# EAGLE design Sensor Acquisition Board Rev3 (EAGLE 9.6.2)
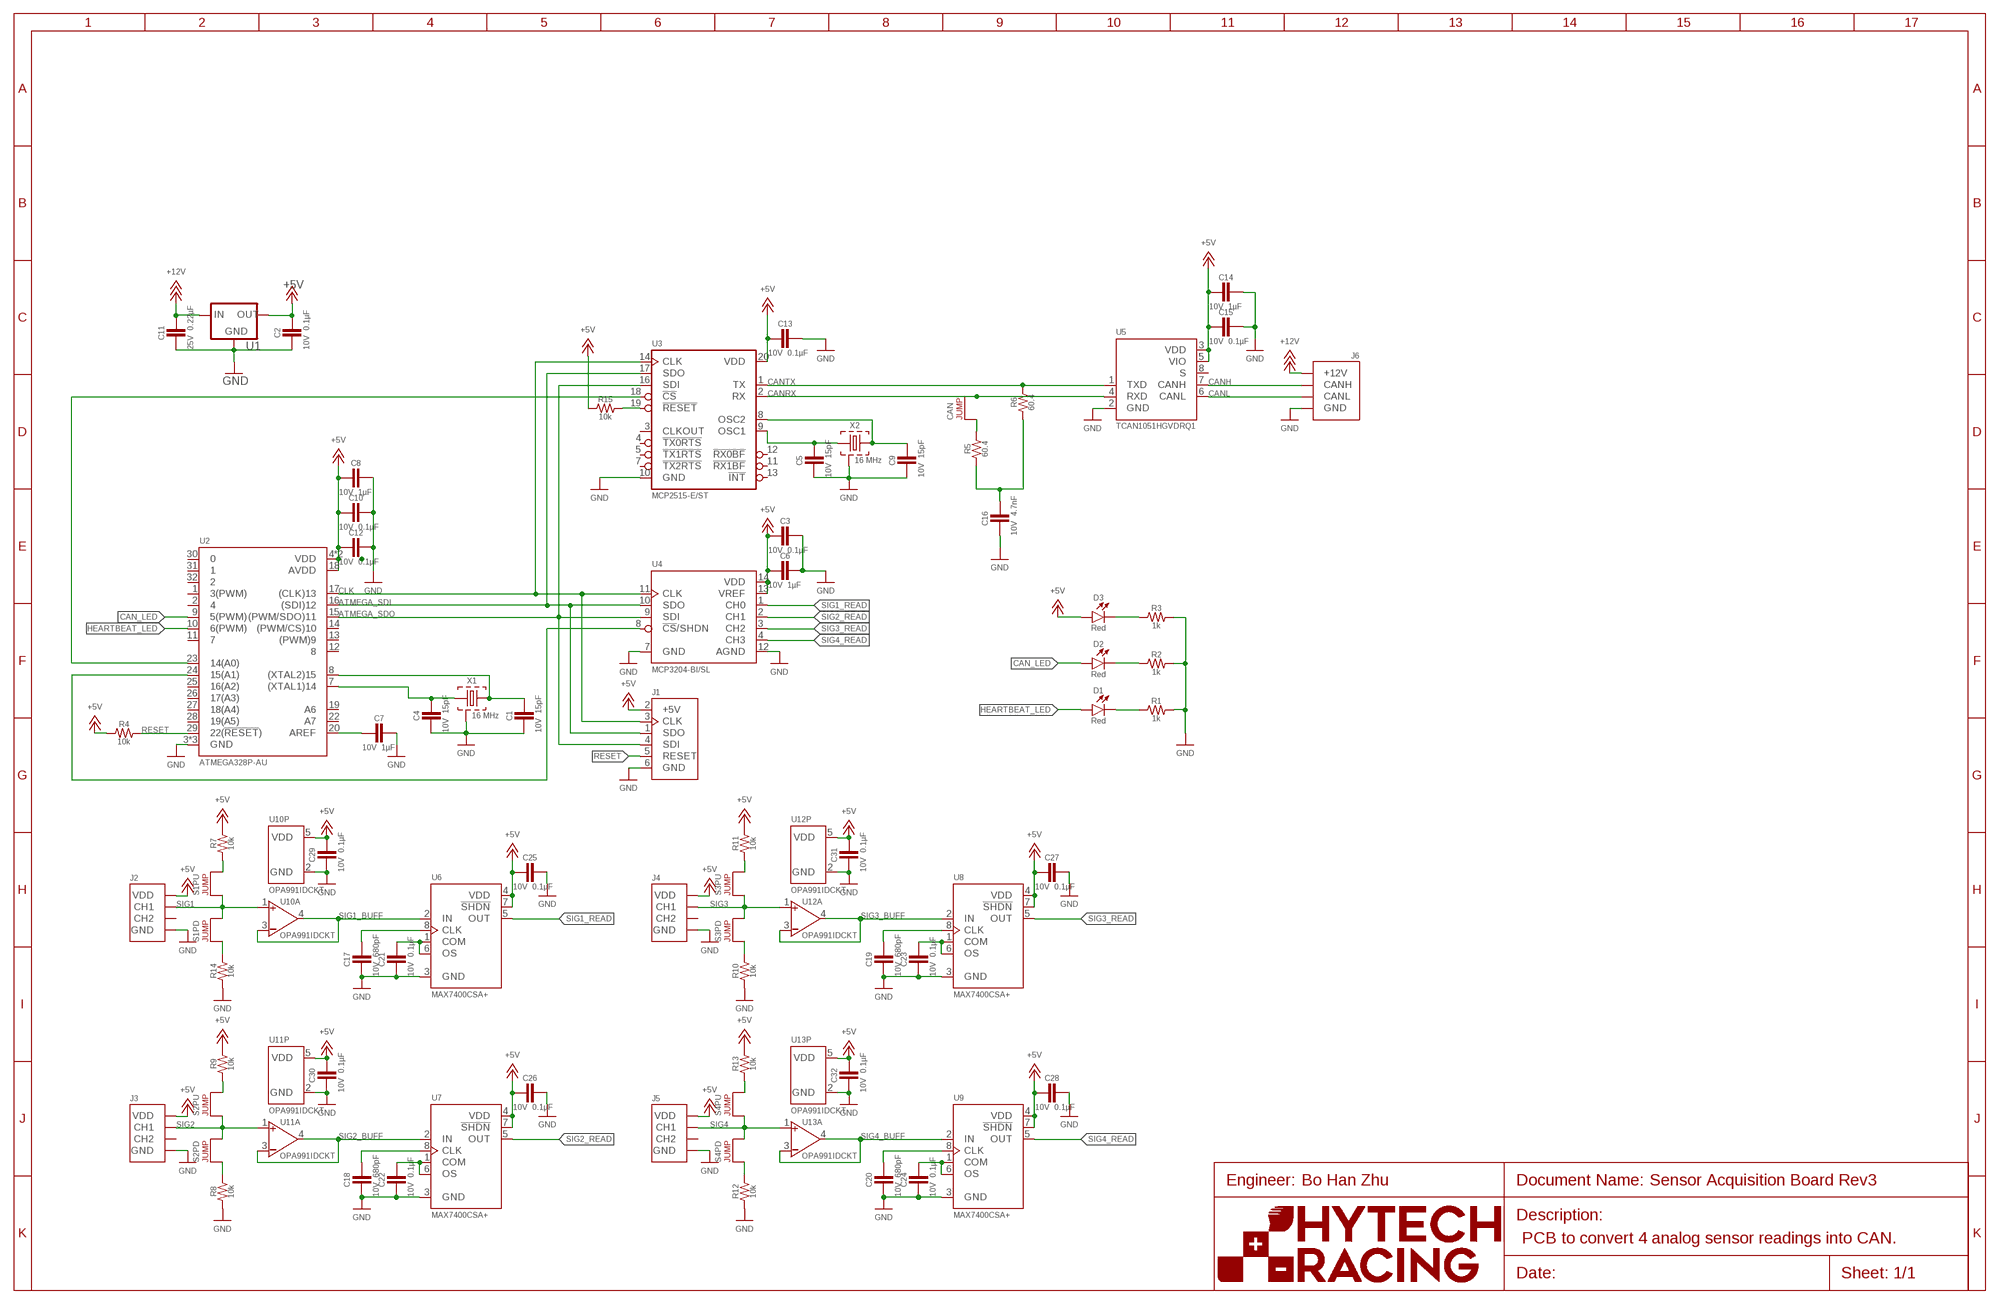
[diagram p0: schematic, sheet 1]
U$7 (FRAME_B): FRAME_DESCRIPTION: Default; ORIENTATION: LANDSCAPE; SIZE: B

## Parts
C1  CAPACITOR_0603_10V_15PF  [0603-CAP]
C2  CAPACITOR_0603_10V_0.1UF  [0603-CAP]
C3  CAPACITOR_0603_10V_0.1UF  [0603-CAP]
C4  CAPACITOR_0603_10V_15PF  [0603-CAP]
C5  CAPACITOR_0603_10V_15PF  [0603-CAP]
C6  CAPACITOR_0603_10V_1UF  [0603-CAP]
C7  CAPACITOR_0603_10V_1UF  [0603-CAP]
C8  CAPACITOR_0603_10V_1UF  [0603-CAP]
C9  CAPACITOR_0603_10V_15PF  [0603-CAP]
C10  CAPACITOR_0603_10V_0.1UF  [0603-CAP]
C11  CAPACITOR_0603_25V_0.22UF  [0603-CAP]
C12  CAPACITOR_0603_10V_0.1UF  [0603-CAP]
C13  CAPACITOR_0603_10V_0.1UF  [0603-CAP]
C14  CAPACITOR_0603_10V_1UF  [0603-CAP]
C15  CAPACITOR_0603_10V_0.1UF  [0603-CAP]
C16  CAPACITOR_0603_10V_4.7NF  [0603-CAP]
C17  CAPACITOR_0603_10V_680PF  [0603-CAP]
C18  CAPACITOR_0603_10V_680PF  [0603-CAP]
C19  CAPACITOR_0603_10V_680PF  [0603-CAP]
C20  CAPACITOR_0603_10V_680PF  [0603-CAP]
C21  CAPACITOR_0603_10V_0.1UF  [0603-CAP]
C22  CAPACITOR_0603_10V_0.1UF  [0603-CAP]
C23  CAPACITOR_0603_10V_0.1UF  [0603-CAP]
C24  CAPACITOR_0603_10V_0.1UF  [0603-CAP]
C25  CAPACITOR_0603_10V_0.1UF  [0603-CAP]
C26  CAPACITOR_0603_10V_0.1UF  [0603-CAP]
C27  CAPACITOR_0603_10V_0.1UF  [0603-CAP]
C28  CAPACITOR_0603_10V_0.1UF  [0603-CAP]
C29  CAPACITOR_0603_10V_0.1UF  [0603-CAP]
C30  CAPACITOR_0603_10V_0.1UF  [0603-CAP]
C31  CAPACITOR_0603_10V_0.1UF  [0603-CAP]
C32  CAPACITOR_0603_10V_0.1UF  [0603-CAP]
CAN  JUMPER_1X02_  [1X02]
D1  LED_0603_RED  [0603-LED]
D2  LED_0603_RED  [0603-LED]
D3  LED_0603_RED  [0603-LED]
J1  CONNECTOR-AVR-ISP__  [2X03]
J2  CONNECTOR-SENSOR_NF_S_RA_BLACK  [MOLEX_NANOFIT_SMD_RIGHTANGLE_04]
J3  CONNECTOR-SENSOR_NF_S_RA_BLACK  [MOLEX_NANOFIT_SMD_RIGHTANGLE_04]
J4  CONNECTOR-SENSOR_NF_S_RA_BLACK  [MOLEX_NANOFIT_SMD_RIGHTANGLE_04]
J5  CONNECTOR-SENSOR_NF_S_RA_BLACK  [MOLEX_NANOFIT_SMD_RIGHTANGLE_04]
J6  CONNECTOR-CAN_NF_S_RA_BLACK  [MOLEX_NANOFIT_SMD_RIGHTANGLE_04]
R1  RESISTOR_0603_1K  [0603-RES]
R2  RESISTOR_0603_1K  [0603-RES]
R3  RESISTOR_0603_1K  [0603-RES]
R4  RESISTOR_0603_10K  [0603-RES]
R5  RESISTOR_0603_60.4  [0603-RES]
R6  RESISTOR_0603_60.4  [0603-RES]
R7  RESISTOR_0603_10K  [0603-RES]
R8  RESISTOR_0603_10K  [0603-RES]
R9  RESISTOR_0603_10K  [0603-RES]
R10  RESISTOR_0603_10K  [0603-RES]
R11  RESISTOR_0603_10K  [0603-RES]
R12  RESISTOR_0603_10K  [0603-RES]
R13  RESISTOR_0603_10K  [0603-RES]
R14  RESISTOR_0603_10K  [0603-RES]
R15  RESISTOR_0603_10K  [0603-RES]
S1PD  JUMPER_1X02_  [1X02]
S1PU  JUMPER_1X02_  [1X02]
S2PD  JUMPER_1X02_  [1X02]
S2PU  JUMPER_1X02_  [1X02]
S3PD  JUMPER_1X02_  [1X02]
S3PU  JUMPER_1X02_  [1X02]
S4PD  JUMPER_1X02_  [1X02]
S4PU  JUMPER_1X02_  [1X02]
U1  LM340  [SOT223]
U2  ATMEGA328P-AU  [TQFP-32]
U3  MCP2515  [TSSOP-20]
U4  MCP3204  [SOIC-14]
U5  CAN_TRANSCIEVER_TCAN1051HQV-Q1  [SOIC-08]
U6  MAX7400  [SOIC-08(NARROW,0.15")]
U7  MAX7400  [SOIC-08(NARROW,0.15")]
U8  MAX7400  [SOIC-08(NARROW,0.15")]
U9  MAX7400  [SOIC-08(NARROW,0.15")]
U10  OPAMP_1_CHANNEL_OPA991  [SC-70-5]
U11  OPAMP_1_CHANNEL_OPA991  [SC-70-5]
U12  OPAMP_1_CHANNEL_OPA991  [SC-70-5]
U13  OPAMP_1_CHANNEL_OPA991  [SC-70-5]
X1  CRYSTAL16MHZ  [ABM3B]
X2  CRYSTAL16MHZ  [ABM3B]

## Nets
+5V: C2.1 C3.2 C6.2 C8.2 C10.2 C12.2 C13.2 C14.2 C15.2 C25.2 C26.2 C27.2 C28.2 C29.1 C30.1 C31.1 C32.1 D3.2(A) J1.2(+5V) J2.1(VDD) J3.1(VDD) J4.1(VDD) J5.1(VDD) R4.1 R7.2 R9.2 R11.2 R13.2 R15.1 U1.3(OUT) U2.4(VDD) U2.6(VDD) U2.18(AVDD) U3.20(VDD) U4.13(VREF) U4.14(VDD) U5.3(VDD) U5.5(VIO) U6.4(VDD) U6.7(!SHDN) U7.4(VDD) U7.7(!SHDN) U8.4(VDD) U8.7(!SHDN) U9.4(VDD) U9.7(!SHDN) U10.5(P:VDD) U11.5(P:VDD) U12.5(P:VDD) U13.5(P:VDD)
+12V: C11.1 J6.1(+12V) U1.1(IN)
ATMEGA_CS: U2.24(15(A1)) U4.8(!CS!/SHDN)
ATMEGA_SDI: J1.1(SDO) U2.16((SDI)12) U3.17(SDO) U4.10(SDO)
ATMEGA_SDO: J1.4(SDI) U2.15((PWM/SDO)11) U3.16(SDI) U4.9(SDI)
CAN_LED: D2.2(A) U2.9(5(PWM))
CANH: J6.4(CANH) U5.7(CANH)
CANL: J6.3(CANL) U5.6(CANL)
CANRX: CAN.2 U3.2(RX) U5.4(RXD)
CANTX: R6.2 U3.1(TX) U5.1(TXD)
CLK: J1.3(CLK) U2.17((CLK)13) U3.14(CLK) U4.11(CLK)
GND: C1.2 C2.2 C3.1 C4.2 C5.2 C6.1 C7.1 C8.1 C9.2 C10.1 C11.2 C12.1 C13.1 C14.1 C15.1 C16.2 C17.2 C18.2 C19.2 C20.2 C21.2 C22.2 C23.2 C24.2 C25.1 C26.1 C27.1 C28.1 C29.2 C30.2 C31.2 C32.2 J1.6(GND) J2.2(GND) J3.2(GND) J4.2(GND) J5.2(GND) J6.2(GND) R1.2 R2.2 R3.2 R8.1 R10.1 R12.1 R14.1 U1.2(GND) U1.4(GND) U2.3(GND) U2.5(GND) U2.21(GND) U3.10(GND) U4.7(GND) U4.12(AGND) U5.2(GND) U6.3(GND) U7.3(GND) U8.3(GND) U9.3(GND) U10.2(P:GND) U11.2(P:GND) U12.2(P:GND) U13.2(P:GND) X1.2(GND) X1.4(GND) X2.2(GND) X2.4(GND)
HEARTBEAT_LED: D1.2(A) U2.10(6(PWM))
N$1: CAN.1 R5.2
N$2: C16.1 R5.1 R6.1
N$3: C17.1 U6.8(CLK)
N$4: C21.1 U6.1(COM) U6.6(OS)
N$5: R15.2 U3.19(!RESET)
N$6: D3.1(C) R3.1
N$8: D2.1(C) R2.1
N$9: D1.1(C) R1.1
N$12: U2.23(14(A0)) U3.18(!CS)
N$15: C5.1 U3.9(OSC1) X2.1
N$16: C9.1 U3.8(OSC2) X2.3
N$17: C4.1 U2.7((XTAL1)14) X1.1
N$18: C1.1 U2.8((XTAL2)15) X1.3
N$19: C7.2 U2.20(AREF)
N$20: R7.1 S1PU.2
N$21: R14.2 S1PD.1
N$22: C18.1 U7.8(CLK)
N$23: C22.1 U7.1(COM) U7.6(OS)
N$27: R9.1 S2PU.2
N$28: R8.2 S2PD.1
N$29: C19.1 U8.8(CLK)
N$30: C23.1 U8.1(COM) U8.6(OS)
N$34: R11.1 S3PU.2
N$35: R10.2 S3PD.1
N$36: C20.1 U9.8(CLK)
N$37: C24.1 U9.1(COM) U9.6(OS)
N$41: R13.1 S4PU.2
N$42: R12.2 S4PD.1
RESET: J1.5(RESET) R4.2 U2.29(22(!RESET!))
SIG1: J2.3(CH1) S1PD.2 S1PU.1 U10.1(A:VIN+)
SIG1_BUFF: U6.2(IN) U10.3(A:VIN-) U10.4(A:VOUT)
SIG1_READ: U4.1(CH0) U6.5(OUT)
SIG2: J3.3(CH1) S2PD.2 S2PU.1 U11.1(A:VIN+)
SIG2_BUFF: U7.2(IN) U11.3(A:VIN-) U11.4(A:VOUT)
SIG2_READ: U4.2(CH1) U7.5(OUT)
SIG3: J4.3(CH1) S3PD.2 S3PU.1 U12.1(A:VIN+)
SIG3_BUFF: U8.2(IN) U12.3(A:VIN-) U12.4(A:VOUT)
SIG3_READ: U4.3(CH2) U8.5(OUT)
SIG4: J5.3(CH1) S4PD.2 S4PU.1 U13.1(A:VIN+)
SIG4_BUFF: U9.2(IN) U13.3(A:VIN-) U13.4(A:VOUT)
SIG4_READ: U4.4(CH3) U9.5(OUT)
Unconnected: J2.4(CH2) J3.4(CH2) J4.4(CH2) J5.4(CH2) U2.1(3(PWM)) U2.2 U2.11 U2.12 U2.13((PWM)9) U2.14((PWM/CS)10) U2.19(A6) U2.22(A7) U2.25(16(A2)) U2.26(17(A3)) U2.27(18(A4)) U2.28(19(A5)) U2.30 U2.31 U2.32 U3.3(CLKOUT) U3.4(!TX0RTS) U3.5(!TX1RTS) U3.7(!TX2RTS) U3.11(!RX1BF) U3.12(!RX0BF) U3.13(!INT) U5.8(S)

## Notes on the sheet
- Bo Han Zhu
- PCB to convert 4 analog sensor readings into CAN.

## Library data of the parts
C1 C4 C5 C9 = HyTechDevices:CAPACITOR_?_*: Capacitor, Non-Polarized VJ...1BC Series Datasheet <https://www.mouser.com/datasheet/2/427/vjw1bcbascomseries-1762447.pdf> Samsung Datasheet <https://www.mouser.com/datasheet/2/585/MLCC-1837944.pdf> Walsin Datasheet <https://www.mouser.com/datasheet/2/210/WTC_MLCC_General_Purpose-1534899.pdf> GRM188R61A226ME15D <https://www.mouser.com/datasheet/2/281/1/GRM188R61A226ME15_02A-1985787.pdf> GRM188R61E106MA73D <https://www.mouser.com/datasheet/2/281/1/GRM188R61E106MA73_01A-1985806.pdf> 885012006013 <https://www.mouser.com/datasheet/2/445/885012006013-1726946.pdf> 2220Y6300105KXTWS2 <https://www.mouser.com/datasheet/2/218/SMD_High_and_Std_StackiCap_P62-1825512.pdf> Yageo Class 2, X5R <https://www.mouser.com/datasheet/2/447/UPY_GPHC_X5R_4V_to_50V_26-1827097.pdf> TDK C Series <https://www.mouser.com/ProductDetail/TDK/C3216X5R1V226M160AC?qs=%2Fha2pyFadujbcx9jh7lYl%2F4NeMoXFhdc8AqVWNq4wW6M2y7zl6GzBuhgtI0ngznN> AVX Automotive MLCC <https://www.mouser.com/datasheet/2/40/AutoMLCC-777028.pdf> KEMET X7R Series <https://www.mouser.com/datasheet/2/212/KEM_C1002_X7R_SMD-1102033.pdf>; CAPACITANCE: 15pF; DKPN: 720-VJ0603A150FXQPW1BCCT-ND; MANUFACTURER: Vishay Vitramon; MOPN: 77-VJ0603A150FXQPBC; MPN: VJ0603A150FXQPW1BC; TOLERANCE: 1%; VOLTAGE: 10V
C2 C3 C10 C12 C13 C15 C21-C32 = HyTechDevices:CAPACITOR_?_*: Capacitor, Non-Polarized VJ...1BC Series Datasheet <https://www.mouser.com/datasheet/2/427/vjw1bcbascomseries-1762447.pdf> Samsung Datasheet <https://www.mouser.com/datasheet/2/585/MLCC-1837944.pdf> Walsin Datasheet <https://www.mouser.com/datasheet/2/210/WTC_MLCC_General_Purpose-1534899.pdf> GRM188R61A226ME15D <https://www.mouser.com/datasheet/2/281/1/GRM188R61A226ME15_02A-1985787.pdf> GRM188R61E106MA73D <https://www.mouser.com/datasheet/2/281/1/GRM188R61E106MA73_01A-1985806.pdf> 885012006013 <https://www.mouser.com/datasheet/2/445/885012006013-1726946.pdf> 2220Y6300105KXTWS2 <https://www.mouser.com/datasheet/2/218/SMD_High_and_Std_StackiCap_P62-1825512.pdf> Yageo Class 2, X5R <https://www.mouser.com/datasheet/2/447/UPY_GPHC_X5R_4V_to_50V_26-1827097.pdf> TDK C Series <https://www.mouser.com/ProductDetail/TDK/C3216X5R1V226M160AC?qs=%2Fha2pyFadujbcx9jh7lYl%2F4NeMoXFhdc8AqVWNq4wW6M2y7zl6GzBuhgtI0ngznN> AVX Automotive MLCC <https://www.mouser.com/datasheet/2/40/AutoMLCC-777028.pdf> KEMET X7R Series <https://www.mouser.com/datasheet/2/212/KEM_C1002_X7R_SMD-1102033.pdf>; CAPACITANCE: 0.1µF; DKPN: 720-1688-1-ND; MANUFACTURER: Vishay Vitramon; MOPN: 77-VJ0603Y104JXQPBC; MPN: VJ0603Y104JXQPW1BC; TOLERANCE: 5%; VOLTAGE: 10V
C6-C8 C14 = HyTechDevices:CAPACITOR_?_*: Capacitor, Non-Polarized VJ...1BC Series Datasheet <https://www.mouser.com/datasheet/2/427/vjw1bcbascomseries-1762447.pdf> Samsung Datasheet <https://www.mouser.com/datasheet/2/585/MLCC-1837944.pdf> Walsin Datasheet <https://www.mouser.com/datasheet/2/210/WTC_MLCC_General_Purpose-1534899.pdf> GRM188R61A226ME15D <https://www.mouser.com/datasheet/2/281/1/GRM188R61A226ME15_02A-1985787.pdf> GRM188R61E106MA73D <https://www.mouser.com/datasheet/2/281/1/GRM188R61E106MA73_01A-1985806.pdf> 885012006013 <https://www.mouser.com/datasheet/2/445/885012006013-1726946.pdf> 2220Y6300105KXTWS2 <https://www.mouser.com/datasheet/2/218/SMD_High_and_Std_StackiCap_P62-1825512.pdf> Yageo Class 2, X5R <https://www.mouser.com/datasheet/2/447/UPY_GPHC_X5R_4V_to_50V_26-1827097.pdf> TDK C Series <https://www.mouser.com/ProductDetail/TDK/C3216X5R1V226M160AC?qs=%2Fha2pyFadujbcx9jh7lYl%2F4NeMoXFhdc8AqVWNq4wW6M2y7zl6GzBuhgtI0ngznN> AVX Automotive MLCC <https://www.mouser.com/datasheet/2/40/AutoMLCC-777028.pdf> KEMET X7R Series <https://www.mouser.com/datasheet/2/212/KEM_C1002_X7R_SMD-1102033.pdf>; CAPACITANCE: 1µF; DKPN: 311-1796-1-ND; MANUFACTURER: Yageo; MOPN: 603-CC603KRX7R6BB105; MPN: CC0603KRX7R6BB105; TOLERANCE: 10%; VOLTAGE: 10V
C11 = HyTechDevices:CAPACITOR_?_*: Capacitor, Non-Polarized VJ...1BC Series Datasheet <https://www.mouser.com/datasheet/2/427/vjw1bcbascomseries-1762447.pdf> Samsung Datasheet <https://www.mouser.com/datasheet/2/585/MLCC-1837944.pdf> Walsin Datasheet <https://www.mouser.com/datasheet/2/210/WTC_MLCC_General_Purpose-1534899.pdf> GRM188R61A226ME15D <https://www.mouser.com/datasheet/2/281/1/GRM188R61A226ME15_02A-1985787.pdf> GRM188R61E106MA73D <https://www.mouser.com/datasheet/2/281/1/GRM188R61E106MA73_01A-1985806.pdf> 885012006013 <https://www.mouser.com/datasheet/2/445/885012006013-1726946.pdf> 2220Y6300105KXTWS2 <https://www.mouser.com/datasheet/2/218/SMD_High_and_Std_StackiCap_P62-1825512.pdf> Yageo Class 2, X5R <https://www.mouser.com/datasheet/2/447/UPY_GPHC_X5R_4V_to_50V_26-1827097.pdf> TDK C Series <https://www.mouser.com/ProductDetail/TDK/C3216X5R1V226M160AC?qs=%2Fha2pyFadujbcx9jh7lYl%2F4NeMoXFhdc8AqVWNq4wW6M2y7zl6GzBuhgtI0ngznN> AVX Automotive MLCC <https://www.mouser.com/datasheet/2/40/AutoMLCC-777028.pdf> KEMET X7R Series <https://www.mouser.com/datasheet/2/212/KEM_C1002_X7R_SMD-1102033.pdf>; CAPACITANCE: 0.22µF; DKPN: 1292-1420-1-ND; MANUFACTURER: Walsin Technology Corporation; MOPN: 791-0603B224K250CT; MPN: 0603B224K250CT; TOLERANCE: 10%; VOLTAGE: 25V
C16 = HyTechDevices:CAPACITOR_?_*: Capacitor, Non-Polarized VJ...1BC Series Datasheet <https://www.mouser.com/datasheet/2/427/vjw1bcbascomseries-1762447.pdf> Samsung Datasheet <https://www.mouser.com/datasheet/2/585/MLCC-1837944.pdf> Walsin Datasheet <https://www.mouser.com/datasheet/2/210/WTC_MLCC_General_Purpose-1534899.pdf> GRM188R61A226ME15D <https://www.mouser.com/datasheet/2/281/1/GRM188R61A226ME15_02A-1985787.pdf> GRM188R61E106MA73D <https://www.mouser.com/datasheet/2/281/1/GRM188R61E106MA73_01A-1985806.pdf> 885012006013 <https://www.mouser.com/datasheet/2/445/885012006013-1726946.pdf> 2220Y6300105KXTWS2 <https://www.mouser.com/datasheet/2/218/SMD_High_and_Std_StackiCap_P62-1825512.pdf> Yageo Class 2, X5R <https://www.mouser.com/datasheet/2/447/UPY_GPHC_X5R_4V_to_50V_26-1827097.pdf> TDK C Series <https://www.mouser.com/ProductDetail/TDK/C3216X5R1V226M160AC?qs=%2Fha2pyFadujbcx9jh7lYl%2F4NeMoXFhdc8AqVWNq4wW6M2y7zl6GzBuhgtI0ngznN> AVX Automotive MLCC <https://www.mouser.com/datasheet/2/40/AutoMLCC-777028.pdf> KEMET X7R Series <https://www.mouser.com/datasheet/2/212/KEM_C1002_X7R_SMD-1102033.pdf>; CAPACITANCE: 4.7nF; DKPN: 732-7931-1-ND; MANUFACTURER: Würth Elektronik; MOPN: 710-885012206012; MPN: 885012206012; TOLERANCE: 10%; VOLTAGE: 10V
C17-C20 = HyTechDevices:CAPACITOR_?_*: Capacitor, Non-Polarized VJ...1BC Series Datasheet <https://www.mouser.com/datasheet/2/427/vjw1bcbascomseries-1762447.pdf> Samsung Datasheet <https://www.mouser.com/datasheet/2/585/MLCC-1837944.pdf> Walsin Datasheet <https://www.mouser.com/datasheet/2/210/WTC_MLCC_General_Purpose-1534899.pdf> GRM188R61A226ME15D <https://www.mouser.com/datasheet/2/281/1/GRM188R61A226ME15_02A-1985787.pdf> GRM188R61E106MA73D <https://www.mouser.com/datasheet/2/281/1/GRM188R61E106MA73_01A-1985806.pdf> 885012006013 <https://www.mouser.com/datasheet/2/445/885012006013-1726946.pdf> 2220Y6300105KXTWS2 <https://www.mouser.com/datasheet/2/218/SMD_High_and_Std_StackiCap_P62-1825512.pdf> Yageo Class 2, X5R <https://www.mouser.com/datasheet/2/447/UPY_GPHC_X5R_4V_to_50V_26-1827097.pdf> TDK C Series <https://www.mouser.com/ProductDetail/TDK/C3216X5R1V226M160AC?qs=%2Fha2pyFadujbcx9jh7lYl%2F4NeMoXFhdc8AqVWNq4wW6M2y7zl6GzBuhgtI0ngznN> AVX Automotive MLCC <https://www.mouser.com/datasheet/2/40/AutoMLCC-777028.pdf> KEMET X7R Series <https://www.mouser.com/datasheet/2/212/KEM_C1002_X7R_SMD-1102033.pdf>; CAPACITANCE: 680pF; DKPN: 732-7757-1-ND; MANUFACTURER: Würth Elektronik; MOPN: 710-885012006013; MPN: 885012006013; TOLERANCE: 5%; VOLTAGE: 10V
CAN S1PD S1PU S2PD S2PU S3PD S3PU S4PD S4PU = HyTechDevices:JUMPER_?_*: 2 Pin Connector
D1-D3 = HyTechDevices:LED_?_*: LED Blue <https://www.mouser.com/datasheet/2/216/APT1608VBC_D-246010.pdf> Green <https://www.mouser.com/datasheet/2/216/APT1608ZGCK-1173388.pdf> Orange <https://www.mouser.com/datasheet/2/216/APT1608SECK-6197.pdf> Red <https://www.mouser.com/datasheet/2/216/APT1608SECK-J3-PRV-1173336.pdf> White <https://www.mouser.com/datasheet/2/50/SM0603UWC-880813.pdf> Yellow <https://www.mouser.com/datasheet/2/216/APT1608SYCK-J3-PRV-1173311.pdf>; COLOR: Red; DKPN: 754-1786-1-ND; MANUFACTURER: Kingbright; MOPN: 604-APT1608SECKJ3PRV; MPN: APT1608SECK/J3-PRV
J1 = HyTechDevices:CONNECTOR-AVR-ISP_?_*: AVR ISP 6-pin Header Reference <https://en.wikipedia.org/wiki/In-system_programming>; DKPN: S2011EC-03-ND
J2-J5 = HyTechDevices:CONNECTOR-SENSOR_?_*: HyTech Sensor Connector; MANUFACTURER: Molex; MPN: 105405-1304
J6 = HyTechDevices:CONNECTOR-CAN_?_*: HyTech CAN Connector; MANUFACTURER: Molex; MPN: 105405-1304
R1-R3 = HyTechDevices:RESISTOR_?_*: Resistor PWR163 Series <https://www.mouser.com/datasheet/2/54/pwr163-777985.pdf> AC Series <https://www.mouser.com/datasheet/2/447/Yageo_PYu_AC_51_RoHS_L_7_1714230-1874691.pdf> PU Series <https://www.mouser.com/datasheet/2/447/PYu-PU_51_RoHS_L_6-1504619.pdf> ERA Series <https://www.mouser.com/datasheet/2/315/AOA0000C307-1149632.pdf> PWR263 Series <https://www.mouser.com/datasheet/2/54/pwr263s_35-778069.pdf> RC Series <https://www.mouser.com/datasheet/2/447/Yageo_03_18_2021_PYu_RC_Group_51_RoHS_L_11-2199992.pdf> ERJ PB3, PB6 Series <https://www.mouser.com/datasheet/2/315/AOA0000C328-1530132.pdf> ERJ PA2, P03, PA3, P06, P08, P14 Series <https://www.mouser.com/datasheet/2/315/AOA0000C331-1141874.pdf>; DKPN: 311-1.00KHRCT-ND; MANUFACTURER: Yageo; MOPN: 603-RC0603FR-071KL; MPN: RC0603FR-071KL; POWER: 0.1W; RESISTANCE: 1k; TOLERANCE: 1%; VOLTAGE_CONTINUOUS: 10.00V; VOLTAGE_MAX: 75V
R4 R7-R15 = HyTechDevices:RESISTOR_?_*: Resistor PWR163 Series <https://www.mouser.com/datasheet/2/54/pwr163-777985.pdf> AC Series <https://www.mouser.com/datasheet/2/447/Yageo_PYu_AC_51_RoHS_L_7_1714230-1874691.pdf> PU Series <https://www.mouser.com/datasheet/2/447/PYu-PU_51_RoHS_L_6-1504619.pdf> ERA Series <https://www.mouser.com/datasheet/2/315/AOA0000C307-1149632.pdf> PWR263 Series <https://www.mouser.com/datasheet/2/54/pwr263s_35-778069.pdf> RC Series <https://www.mouser.com/datasheet/2/447/Yageo_03_18_2021_PYu_RC_Group_51_RoHS_L_11-2199992.pdf> ERJ PB3, PB6 Series <https://www.mouser.com/datasheet/2/315/AOA0000C328-1530132.pdf> ERJ PA2, P03, PA3, P06, P08, P14 Series <https://www.mouser.com/datasheet/2/315/AOA0000C331-1141874.pdf>; DKPN: 311-10.0KHRCT-ND; MANUFACTURER: Yageo; MOPN: 603-RC0603FR-0710KL; MPN: RC0603FR-0710KL; POWER: 0.1W; RESISTANCE: 10k; TOLERANCE: 1%; VOLTAGE_CONTINUOUS: 31.62V; VOLTAGE_MAX: 75V
R5 R6 = HyTechDevices:RESISTOR_?_*: Resistor PWR163 Series <https://www.mouser.com/datasheet/2/54/pwr163-777985.pdf> AC Series <https://www.mouser.com/datasheet/2/447/Yageo_PYu_AC_51_RoHS_L_7_1714230-1874691.pdf> PU Series <https://www.mouser.com/datasheet/2/447/PYu-PU_51_RoHS_L_6-1504619.pdf> ERA Series <https://www.mouser.com/datasheet/2/315/AOA0000C307-1149632.pdf> PWR263 Series <https://www.mouser.com/datasheet/2/54/pwr263s_35-778069.pdf> RC Series <https://www.mouser.com/datasheet/2/447/Yageo_03_18_2021_PYu_RC_Group_51_RoHS_L_11-2199992.pdf> ERJ PB3, PB6 Series <https://www.mouser.com/datasheet/2/315/AOA0000C328-1530132.pdf> ERJ PA2, P03, PA3, P06, P08, P14 Series <https://www.mouser.com/datasheet/2/315/AOA0000C331-1141874.pdf>; DKPN: 311-60.4HRCT-ND; MANUFACTURER: Yageo; MOPN: 603-RC0603FR-0760R4L; MPN: RC0603FR-0760R4L; POWER: 0.1W; RESISTANCE: 60.4; TOLERANCE: 1%; VOLTAGE_CONTINUOUS: 2.48V; VOLTAGE_MAX: 75V
U1 = HyTechDevices:LM340: LM340 7.5-35V to 5V SMD regulator Mouser link <https://www.mouser.com/ProductDetail/Texas-Instruments/LM340MPX-50-NOPB?qs=sGAEpiMZZMvu8NZDyZ4K0cQiG3JqdhEW>
U2 = HyTechDevices:ATMEGA328P-AU: ATmega328P Datasheet <https://www.mouser.com/datasheet/2/268/ATmega48A_PA_88A_PA_168A_PA_328_P_DS_DS40002061B-1900559.pdf>; DKPN: ATMEGA328P-AURCT-ND; MANUFACTURER: Microchip Technology; MOPN: 556-ATMEGA328P-AU; MPN: ATMEGA328P-AU
U3 = HyTechDevices:MCP2515: MCP2515 Can Controller Datasheet <https://www.mouser.com/datasheet/2/268/MCP2515-Stand-Alone-CAN-Controller-with-SPI-200018-708845.pdf>; DKPN: MCP2515-E/ST-ND; MANUFACTURER: Microchip Technology; MOPN: 579-MCP2515-E/ST; MPN: MCP2515-E/ST
U4 = HyTechDevices:MCP3204: MCP3204 4-Channel ADC Datasheet <https://www.mouser.com/datasheet/2/268/21298c-68472.pdf>; DKPN: MCP3204-BI/SL-ND; MANUFACTURER: Microchip Technology; MOPN: 579-MCP3204-BI/SL; MPN: MCP3204-BI/SL
U5 = HyTechDevices:CAN_TRANSCIEVER_TCAN1051*V-Q1: TCAN1051*V Can Tranciever Datasheet <https://www.ti.com/lit/ds/symlink/tcan1051hgv-q1.pdf?HQS=dis-mous-null-mousermode-dsf-pf-null-wwe&ts=1610765132518&ref_url=https%253A%252F%252Fwww.mouser.com%252Ff>; DKPN: 296-49935-1-ND; MANUFACTURER: Texas Instruments; MOPN: 595-TCAN1051HGVDQ1; MPN: TCAN1051HGVDRQ1
U6-U9 = HyTechDevices:MAX74*: 8th-Order Maxim Filter MAX7480 Datasheet <https://www.mouser.com/datasheet/2/256/MAX7480-1515905.pdf> MAX7400 Datsheet <https://www.mouser.com/datasheet/2/256/MAX7404-1514314.pdf> MAX7400, 7404 uses a 680 pF clock capcitor; DKPN: MAX7400CSA+-ND; MANUFACTURER: Maxim Integrated; MOPN: 700-MAX7400CSA; MPN: MAX7400CSA+
U10-U13 = HyTechDevices:OPAMP_1_CHANNEL_*: Op-Amp 1 Channel OPA991 Datasheet <https://www.ti.com/lit/ds/symlink/opa991.pdf?ts=1615503614502> Note: OPA991 is also a comparator; MPN: OPA991IDCKT
X1 X2 = HyTechDevices:CRYSTAL: Crystal 7B-16-000MEEQ-T Datasheet <http://www.txccrystal.com/images/pdf/7b-accuracy.pdf> 7B-16-000MEEQ-T should be used with the following capcaitor: VJ0603A150FXQPW1BC; DKPN: 887-1298-1-ND; FREQUENCY: 16 MHz; LOAD_CAPACITANCE: 10pF; MANUFACTURER: TXC CORPORATION; MOPN: 717-7B-16.000MEEQ-T; MPN: 7B-16.000MEEQ-T; SHUNT_CAPACITANCE: 2 - 5 pF

## Board
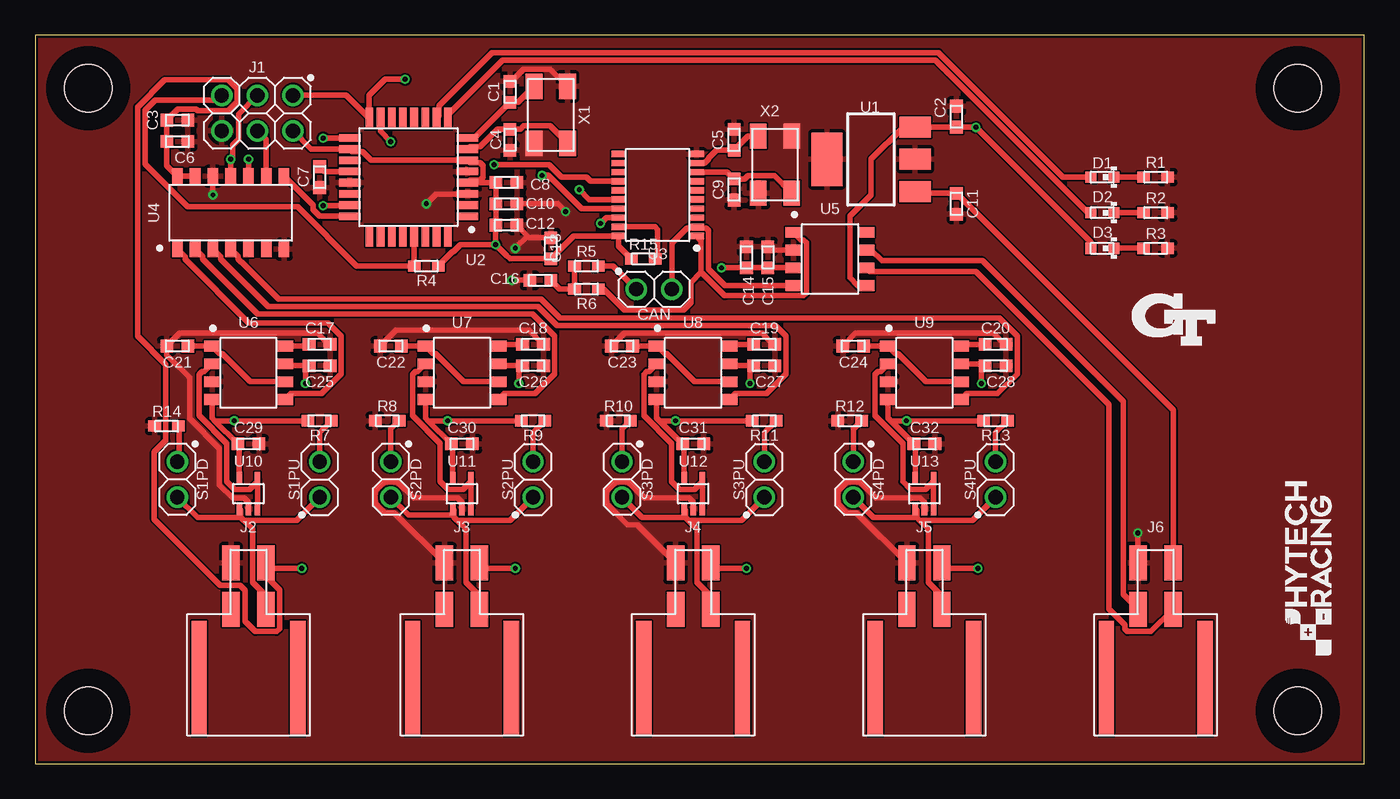
[diagram p1: board, top side]
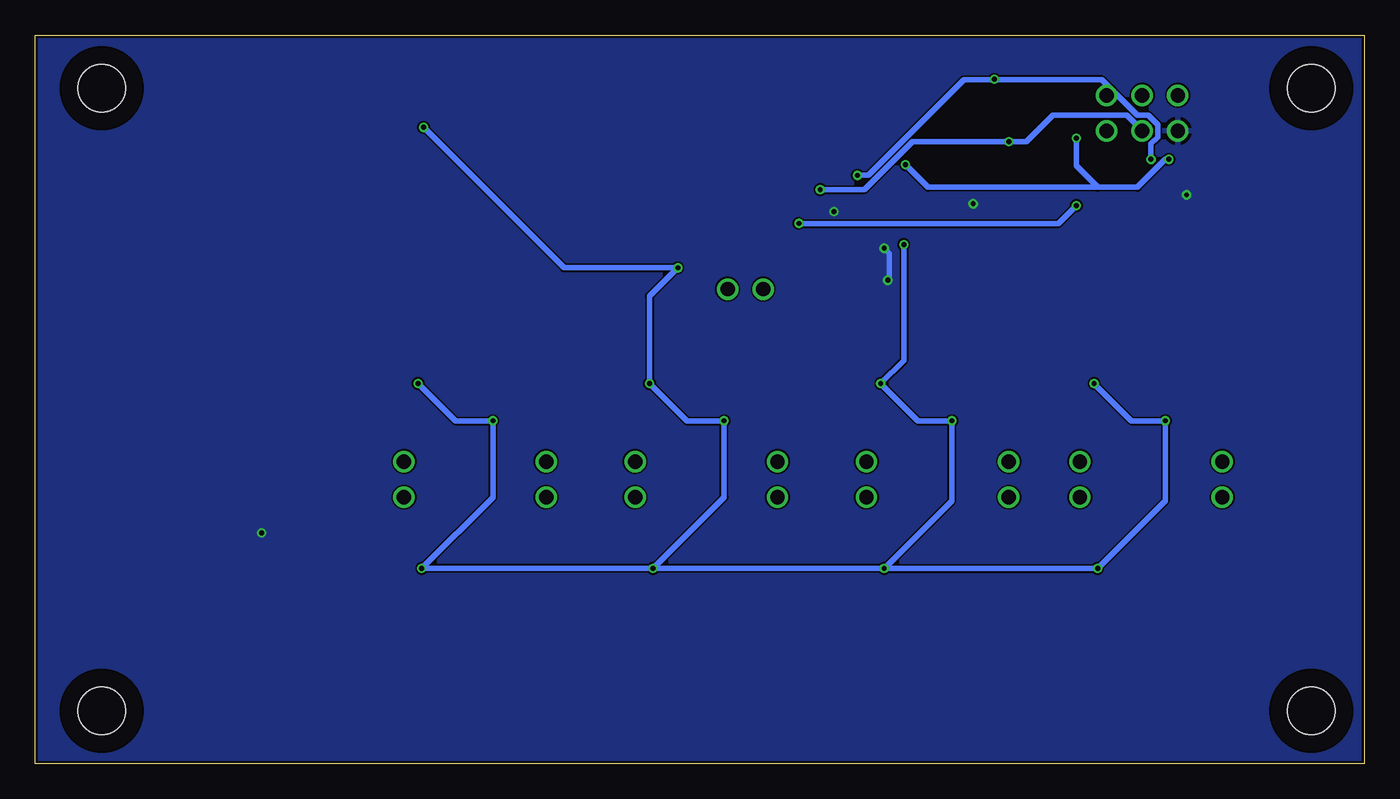
[diagram p2: board, bottom side, seen from below]

Size 94.92 x 52.06 mm. Coordinates in mm from the lower left corner, seen from the top.
Outline: 0,0 94.92,0 94.92,52.06 0,52.06 0,0
Copper layers (1*16): Top 0.035mm / dielectric 1.53mm / Bottom 0.035mm
Design rules "JLCPCB (2 Layer)": minimum track width 5mil, minimum drill 0.3mm, track to track 5mil, track to pad 5mil, pad to pad 5mil, via to via 20mil, smd to smd 5mil, copper to edge 0.2mm, drill to drill 21mil, minimum pad ring 6mil, minimum via ring 6mil, stop-mask expansion 6mil, vias tented up to drill 30mil, thermal gap 10mil

### Footprints (pad centres in the part's own frame; a part is rotated, then mirrored left to right if it is on the bottom)
0603-CAP = smd 0.9 x 0.9: 1 -0.75,0; 2 0.75,0
1X02 = drill 1.016: 1 -1.27,0; 2 1.27,0
0603-LED = smd 0.8 x 0.8: 1 -0.825,0; 2 0.825,0
2X03 = drill 1.016: 1 -2.54,-1.27; 2 -2.54,1.27; 3 0,-1.27; 4 0,1.27; 5 2.54,-1.27; 6 2.54,1.27
MOLEX_NANOFIT_SMD_RIGHTANGLE_04 = smd 1.24 x 2.5: 1 1.25,1.65; 2 -1.25,1.65; 3 1.25,-1.65; 4 -1.25,-1.65 | smd 1.1 x 8.2: PAD1 -3.52,-6.58; PAD@1 3.52,-6.58
0603-RES = smd 0.9 x 0.8: 1 -0.85,0; 2 0.85,0
SOT223 = smd 1.5 x 2.235: 1 -2.3,-3.15; 2 0,-3.15; 3 2.3,-3.15 | smd 3.8 x 2.2: 4 0,3.15
TQFP-32 = smd 1.55 x 0.55: 1 -4.2,2.8; 2 -4.2,2; 3 -4.2,1.2; 4 -4.2,0.4; 5 -4.2,-0.4; 6 -4.2,-1.2; 7 -4.2,-2; 8 -4.2,-2.8; 17 4.2,-2.8; 18 4.2,-2; 19 4.2,-1.2; 20 4.2,-0.4; 21 4.2,0.4; 22 4.2,1.2; 23 4.2,2; 24 4.2,2.8 | smd 0.55 x 1.55: 9 -2.8,-4.2; 10 -2,-4.2; 11 -1.2,-4.2; 12 -0.4,-4.2; 13 0.4,-4.2; 14 1.2,-4.2; 15 2,-4.2; 16 2.8,-4.2; 25 2.8,4.2; 26 2,4.2; 27 1.2,4.2; 28 0.4,4.2; 29 -0.4,4.2; 30 -1.2,4.2; 31 -2,4.2; 32 -2.8,4.2
TSSOP-20 = smd 0.45 x 1.05: 1 -2.925,-2.775; 2 -2.275,-2.775; 3 -1.625,-2.775; 4 -0.975,-2.775; 5 -0.325,-2.775; 6 0.325,-2.775; 7 0.975,-2.775; 8 1.625,-2.775; 9 2.275,-2.775; 10 2.925,-2.775; 11 2.925,2.775; 12 2.275,2.775; 13 1.625,2.775; 14 0.975,2.775; 15 0.325,2.775; 16 -0.325,2.775; 17 -0.975,2.775; 18 -1.625,2.775; 19 -2.275,2.775; 20 -2.925,2.775
SOIC-14 = smd 0.762 x 1.143: 1 -3.81,-2.603; 2 -2.54,-2.603; 3 -1.27,-2.603; 4 0,-2.603; 5 1.27,-2.603; 6 2.54,-2.603; 7 3.81,-2.603; 8 3.81,2.603; 9 2.54,2.603; 10 1.27,2.603; 11 0,2.603; 12 -1.27,2.603; 13 -2.54,2.603; 14 -3.81,2.603
SOIC-08 = smd 0.762 x 1.143: 1 -1.905,-2.603; 2 -0.635,-2.603; 3 0.635,-2.603; 4 1.905,-2.603; 5 1.905,2.603; 6 0.635,2.603; 7 -0.635,2.603; 8 -1.905,2.603
SOIC-08(NARROW,0.15") = smd 0.762 x 1.143: 1 -1.905,-2.603; 2 -0.635,-2.603; 3 0.635,-2.603; 4 1.905,-2.603; 5 1.905,2.603; 6 0.635,2.603; 7 -0.635,2.603; 8 -1.905,2.603
SC-70-5 = smd 0.4 x 0.9: 1 -0.65,-1.1; 2 0,-1.1; 3 0.65,-1.1; 4 0.65,1.1; 5 -0.65,1.1
MOUNTING_M3 = hole 3.4: 0,0
ABM3B = smd 1.803 x 1.194: 1 -2.032,-1.194; 2 2.032,-1.194; 3 2.032,1.194; 4 -2.032,1.194

### Placement (x,y rotation side)
C1  33.91,48.01 90 top
C2  65.79,46.23 90 top
C3  10.16,45.97 180 top
C4  33.91,44.58 270 top
C5  49.91,44.58 90 top
C6  10.16,44.45 180 top
C7  20.32,41.91 90 top
C8  33.66,41.53 180 top
C9  49.91,41.02 270 top
C10  33.66,40.01 180 top
C11  65.79,40.01 270 top
C12  33.66,38.48 180 top
C13  36.83,36.83 270 top
C14  50.8,36.2 270 top
C15  52.32,36.2 270 top
C16  36.07,34.54 180 top
C17  20.32,29.97 0 top
C18  35.56,29.97 0 top
C19  52.07,29.97 0 top
C20  68.58,29.97 0 top
C21  10.16,29.84 180 top
C22  25.4,29.84 180 top
C23  41.91,29.84 180 top
C24  58.42,29.84 180 top
C25  20.32,28.45 180 top
C26  35.56,28.45 180 top
C27  52.07,28.45 180 top
C28  68.58,28.45 180 top
C29  15.24,22.86 0 top
C30  30.48,22.86 0 top
C31  46.99,22.86 0 top
C32  63.5,22.86 0 top
CAN  44.2,33.91 0 top
D1  76.2,41.91 180 top
D2  76.2,39.37 180 top
D3  76.2,36.83 180 top
J1  15.87,46.48 180 top
J2  15.24,12.7 0 top
J3  30.48,12.7 0 top
J4  46.99,12.7 0 top
J5  63.5,12.7 0 top
J6  80.01,12.7 0 top
R1  80.01,41.91 0 top
R2  80.01,39.37 0 top
R3  80.01,36.83 0 top
R4  27.94,35.56 180 top
R5  39.37,35.56 0 top
R6  39.37,33.91 0 top
R7  20.32,24.51 180 top
R8  25.15,24.51 0 top
R9  35.56,24.51 180 top
R10  41.66,24.51 0 top
R11  52.07,24.51 180 top
R12  58.17,24.51 0 top
R13  68.58,24.51 180 top
R14  9.4,24.13 0 top
R15  43.43,36.07 0 top
S1PD  10.16,20.32 270 top
S1PU  20.32,20.32 90 top
S2PD  25.4,20.32 270 top
S2PU  35.56,20.32 90 top
S3PD  41.91,20.32 270 top
S3PU  52.07,20.32 90 top
S4PD  58.42,20.32 270 top
S4PU  68.58,20.32 90 top
U1  59.69,43.18 90 top
U2  26.67,41.91 180 top
U3  44.45,40.64 90 top
U4  13.97,39.37 0 top
U5  56.77,36.07 270 top
U6  15.24,27.94 270 top
U7  30.48,27.94 270 top
U8  46.99,27.94 270 top
U9  63.5,27.94 270 top
U10  15.24,19.3 0 top
U11  30.48,19.3 0 top
U12  46.99,19.3 0 top
U13  63.5,19.3 0 top
U$1  [MOUNTING_M3]  3.81,48.26 0 top
U$2  [MOUNTING_M3]  90.17,48.26 0 top
U$3  [LOGO_HYTECH_0.5"]  92.71,7.62 90 top
U$4  [MOUNTING_M3]  3.81,3.81 0 top
U$5  [MOUNTING_M3]  90.17,3.81 0 top
U$6  [LOGO_GT_0.25"]  81.28,31.75 0 top
X1  36.83,46.35 90 top
X2  52.83,42.8 270 top

### Tracks (layer width: path | path; a pad name or v marks a point on that pad's centre or on a via)
+5V  (via drill 0.35)
  Top 0.381: 12.84,24.51 C29.1 14.59,22.76 U10.5 | U6.4 12.64,24.71 12.84,24.51 | 28.08,24.51 C30.1 29.83,22.76 U11.5 | U7.4 27.88,24.71 28.08,24.51 | 44.59,24.51 C31.1 46.34,22.76 U12.5 | U8.4 44.39,24.71 44.59,24.51 | 61.1,24.51 C32.1 62.85,22.76 U13.5 | U9.4 60.9,24.71 61.1,24.51 | U6.7 17.97,28.45 C25.2 19.3,28.18 v19.3,27.18 | U7.7 33.21,28.45 C26.2 34.54,28.18 v34.54,27.18 | U8.7 49.72,28.45 C27.2 51.05,28.18 v51.05,27.18 | v67.31,13.97 65.13,13.97 J5.1 | v50.8,13.97 48.62,13.97 J4.1 | v19.05,13.97 16.87,13.97 J2.1 16.49,13.41 17.45,12.44 17.45,9.66 17.25,9.46 15.73,9.46 14.99,10.19 14.99,12.4 14.64,12.76 13.23,12.76 8.52,17.46 8.52,22.27 9.34,23.09 9.34,28.53 7.32,30.55 7.32,46.91 9.26,48.86 13.79,48.86 14.44,48.21 14.44,47.29 13.79,46.65 11.62,46.65 11.5,46.77 10.2,46.77 C3.2 C6.2 9.41,42.72 U4.14 U4.13 | v67.56,27.18 67.56,28.18 C28.2 67.7,28.58 U9.7 | 12.84,24.51 v14.22,24.51 R7.2 | 61.1,24.51 v62.23,24.51 R13.2 | 44.59,24.51 v45.72,24.51 R11.2 | 28.08,24.51 v29.46,24.51 R9.2 | v32.89,37.08 C12.2 C10.2 C8.2 30.89,41.53 U2.4 31.05,41.69 31.79,41.69 31.99,41.89 31.99,42.73 31.79,42.93 31.05,42.93 U2.6 24,43.11 23.39,43.73 22.65,43.73 U2.18 19.72,43.91 J1.2 | U5.3 52.34,35.43 C15.2 C14.2 49.03,35.45 v49.02,35.43 | R4.1 29.82,36.59 29.89,36.59 30.38,37.08 v32.89,37.08 | v34.29,13.97 32.11,13.97 J3.1 | D3.2 75.38,37.27 v67.18,45.47 65.8,45.47 C2.1 U1.3 61.99,45.48 59.69,43.18 59.69,40.64 58.17,39.12 58.17,34.73 58.73,34.16 U5.5 | R15.1 41.67,36.98 U3.20 38.47,37.72 C13.2 33.91,36.08 33.67,36.32 33.66,36.32 v32.89,37.08
  Bottom 0.381: v19.3,27.18 16.64,24.51 v14.22,24.51 14.22,18.8 v19.05,13.97 v34.29,13.97 | v34.29,13.97 29.46,18.8 v29.46,24.51 31.88,24.51 v34.54,27.18 32.89,28.83 v32.89,37.08 | v50.8,13.97 45.72,19.05 v45.72,24.51 48.39,24.51 v51.05,27.18 51.05,33.4 v49.02,35.43 57.15,35.43 v67.18,45.47 | v67.56,27.18 64.9,24.51 v62.23,24.51 62.23,19.05 v67.31,13.97 v50.8,13.97 | v34.29,13.97 v50.8,13.97
+12V
  Top 0.381: U1.1 62.96,40.76 C11.1 81.26,25.28 J6.1
ATMEGA_CS
  Top 0.381: U4.8 19.85,39.9 19.85,39.58 20.32,39.11 U2.24
ATMEGA_SDI  (via drill 0.35)
  Top 0.381: v26.42,48.9 25,48.9 23.87,47.76 U2.16 22.23,47.75 J1.1 | U3.17 39.01,39.66 36.64,42.04 v36.19,42.04 | U4.10 v15.24,43.18
  Bottom 0.381: 26.46,48.85 v26.42,48.9 | v36.19,42.04 35.43,42.04 28.61,48.85 26.46,48.85 | v15.24,43.18 15.24,44.28 14.77,44.75 14.77,45.67 15.42,46.32 16.23,46.32 18.76,48.85 26.46,48.85
ATMEGA_SDO  (via drill 0.35)
  Top 0.381: U3.16 39.57,40.31 v38.86,41.02 | v25.4,44.45 24.67,45.18 U2.15 | U4.9 16.51,44.58 J1.4
  Bottom 0.381: v38.86,41.02 35.69,41.02 32.26,44.45 v25.4,44.45 24.13,44.45 22.26,46.32 16.98,46.32 J1.4
CAN_LED
  Top 0.381: U2.9 29.47,46.34 33.4,50.27 64.28,50.27 75.18,39.37 D2.2
CANH
  Top 0.381: U5.7 59.69,36.7 60.45,35.94 67.65,35.94 77.69,25.9 77.69,12.12 J6.4
CANL
  Top 0.381: J6.3 79.67,9.46 78,9.46 77.8,9.66 77.8,9.95 76.67,11.07 76.67,25.69 67.18,35.18 59.63,35.18 U5.6
CANRX
  Top 0.381: U5.4 49.27,34.16 48.09,35.34 48.09,38.08 47.89,38.28 47.31,38.28 U3.2 47.14,38.28 46.56,38.28 45.47,37.19 CAN.2
CANTX
  Top 0.381: U5.1 54.71,37.43 54.88,37.43 55.08,37.23 55.08,33.64 54.88,33.44 49.24,33.44 47.56,35.12 | 47.56,35.12 47.56,37.38 U3.1 | 47.56,35.12 46.83,34.39 46.83,32.94 46.3,32.42 42.09,32.42 40.6,33.91 R6.2
CLK  (via drill 0.35)
  Top 0.381: v20.57,44.7 U2.17 | U4.11 v13.97,43.18 14.1,43.31 14.1,44.19 14.54,44.64 14.54,46.42 J1.3 | v32.77,42.8 36.7,42.8 37.59,41.91 39.37,41.91 39.66,41.62 U3.14
  Bottom 0.381: v13.97,43.18 14.22,43.18 16.21,41.19 19.05,41.19 | v32.77,42.8 31.16,41.19 19.05,41.19 | v20.57,44.7 20.57,42.71 19.05,41.19
GND  (via drill 0.35)
  Top 0.381: U11.2 30.47,18.21 30.47,18.7 30.17,19 27.02,19 25.86,20.16 24.94,20.16 24.29,19.51 24.29,18.59 24.94,17.95 25.64,17.95 J3.2 | U13.2 63.49,18.21 63.49,18.7 63.19,19 60.04,19 58.88,20.16 57.96,20.16 57.31,19.51 57.31,18.59 57.96,17.95 58.66,17.95 J5.2 | J4.2 43.01,17.08 42.32,17.08 40.8,18.59 40.8,19.51 41.45,20.16 42.37,20.16 43.53,19 46.68,19 46.98,18.7 46.98,18.21 U12.2 | C20.2 69.21,29.97 68.42,30.77 58.59,30.77 C24.2 | U5.2 52.57,36.7 C15.1 | C17.2 20.96,29.97 20.16,30.77 10.33,30.77 C21.2 9.41,29.21 11.04,27.58 11.04,24.67 13.16,22.55 13.16,19.94 14.11,19 14.93,19 15.23,18.7 15.23,18.21 U10.2 | C19.2 52.7,29.97 51.91,30.77 42.08,30.77 C23.2 | C1.2 34.02,48.76 34.9,49.63 36.78,49.63 X1.2 | C18.2 36.29,29.97 35.27,30.99 25.8,30.99 C22.2 | U4.12 v12.7,40.64 | U2.3 28.64,40.71 v27.94,40.01 | C10.1 37.34,40.01 v37.89,39.46 | J6.2 78.74,14.37 v78.74,16.51 | C12.1 35.17,37.71 | 35.17,37.71 35.29,37.59 36.04,37.59 36.05,37.58 C13.1 | 35.17,37.71 v34.29,36.83 | C16.2 v34.04,34.54
  Bottom 0.381: v34.29,36.83 33.91,36.45 33.91,34.67 v34.04,34.54
  pour Top: 0,102.87 97.79,102.87 110.49,90.17 110.49,-1.27 95.25,-16.51 1.27,-16.51 -19.05,3.81 -19.05,83.82
  pour Bottom: -5.08,57.15 -5.08,1.27 8.89,-12.7 91.44,-12.7 105.41,1.27 105.41,54.61 100.33,59.69 -2.54,59.69
HEARTBEAT_LED
  Top 0.381: U2.10 28.85,46.29 28.85,47.03 32.62,50.8 64.5,50.8 73.39,41.91 D1.2
N$1
  Top 0.381: R5.2 41.27,35.56 CAN.1
N$2
  Top 0.381: R5.1 R6.1 37.45,33.91 C16.1
N$3
  Top 0.381: U6.8 19.44,29.84 C17.1
N$4
  Top 0.381: C21.1 U6.1 13.18,29.3 13.35,29.3 15.34,27.3 U6.6
N$5
  Top 0.152: 44.45,36.23 R15.2
  Top 0.381: U3.19 44.25,38.37 44.45,38.17 44.45,36.23
N$6
  Top 0.381: R3.1 D3.1
N$8
  Top 0.381: R2.1 D2.1
N$9
  Top 0.381: R1.1 D1.1
N$12  (via drill 0.35)
  Top 0.381: v40.39,38.61 40.79,39.02 U3.18 | U2.23 22.44,39.88 v20.57,39.88
  Bottom 0.381: v40.39,38.61 21.84,38.61 v20.57,39.88
N$15
  Top 0.381: X2.1 50.91,44.83 C5.1 48.64,43.83 48.09,43.28 48.09,43.2 47.81,42.91 U3.9
N$16
  Top 0.381: X2.3 52.78,42.01 50.9,42.01 50.66,41.77 C9.1 49.42,42.27 U3.8
N$17
  Top 0.381: U2.7 31.05,44.09 31.79,44.09 33.02,45.33 C4.1 34.66,45.33 34.9,45.57 36.78,45.57 X1.1
N$18
  Top 0.381: X1.3 34.5,47.26 C1.1 31.36,44.71 U2.8
N$19
  Top 0.381: U2.20 20.67,42.31 C7.2
N$20
  Top 0.381: R7.1 20.32,23.66 S1PU.2
N$21
  Top 0.381: S1PD.1 10.29,21.72 10.29,24.09 R14.2
N$22
  Top 0.381: U7.8 33.21,29.97 C18.1
N$23
  Top 0.381: C22.1 U7.1 28.42,29.3 28.59,29.3 30.58,27.3 U7.6
N$27
  Top 0.381: R9.1 35.56,23.66 S2PU.2
N$28
  Top 0.381: R8.2 25.4,23.91 S2PD.1
N$29
  Top 0.381: C19.1 49.72,29.97 U8.8
N$30
  Top 0.381: C23.1 U8.1 44.93,29.3 45.1,29.3 47.09,27.3 U8.6
N$34
  Top 0.381: R11.1 52.07,23.66 S3PU.2
N$35
  Top 0.381: R10.2 41.91,23.91 S3PD.1
N$36
  Top 0.381: C20.1 66.23,29.97 U9.8
N$37
  Top 0.381: C24.1 U9.1 61.44,29.3 61.61,29.3 63.6,27.3 U9.6
N$41
  Top 0.381: R13.1 68.58,23.66 S4PU.2
N$42
  Top 0.381: R12.2 58.42,23.91 S4PD.1
RESET
  Top 0.381: U2.29 27.07,35.58 R4.2 22.96,35.56 18.73,39.79 10.91,39.79 7.85,42.84 7.85,46.69 8.56,47.4 12.98,47.4 J1.5
SIG1
  Top 0.381: 14.9,17.41 14.7,17.61 | 14.7,17.61 14.7,18.1 U10.1 | S1PU.1 18.68,17.41 14.9,17.41 | J2.3 16.49,12 15.53,12.96 15.53,16.78 14.9,17.41 | 14.7,17.61 11.6,17.61 S1PD.2
SIG1_BUFF
  Top 0.381: U10.3 U10.4 15.89,20.17 15.33,19.61 14.25,19.61 13.7,20.16 13.7,22.9 11.72,24.87 11.72,27.83 11.92,28.03 12.09,28.03 U6.2
SIG1_READ
  Top 0.381: U4.1 10.71,36.22 10.71,36.05 15.26,31.5 20.93,31.5 21.86,30.56 21.86,27.86 20.46,26.46 18.26,26.46 U6.5
SIG2
  Top 0.381: 30.14,17.41 29.94,17.61 29.94,17.78 | 29.94,17.78 29.94,18.1 U11.1 | S2PU.1 33.92,17.41 30.14,17.41 | J3.3 31.73,12 30.77,12.96 30.77,16.78 30.14,17.41 | S2PD.2 26.67,17.78 29.94,17.78
SIG2_BUFF
  Top 0.381: U11.3 U11.4 31.13,20.17 30.57,19.61 29.49,19.61 28.94,20.16 28.94,22.9 26.96,24.87 26.96,27.83 27.16,28.03 27.33,28.03 U7.2
SIG2_READ
  Top 0.381: U7.5 33.5,26.46 35.7,26.46 37.1,27.86 37.1,30.56 35.54,32.13 15.9,32.13 11.98,36.05 11.98,36.22 U4.2
SIG3
  Top 0.381: 46.65,17.41 46.45,17.61 | 46.45,17.61 46.45,18.1 U12.1 | S3PU.1 50.43,17.41 46.65,17.41 | J4.3 48.24,12 47.28,12.96 47.28,16.78 46.65,17.41 | S3PD.2 43.35,17.61 46.45,17.61
SIG3_BUFF
  Top 0.381: U12.3 U12.4 47.64,20.17 47.08,19.61 46.99,19.61 46,19.61 45.45,20.16 45.45,22.9 43.47,24.87 43.47,27.83 43.67,28.03 43.84,28.03 U8.2
SIG3_READ
  Top 0.381: U8.5 50.02,26.46 52.21,26.46 53.61,27.86 53.61,30.56 52.88,31.3 37.28,31.3 35.92,32.66 16.64,32.66 13.25,36.05 13.25,36.22 U4.3
SIG4
  Top 0.381: 63.16,17.41 62.96,17.61 | 62.96,17.61 62.96,18.1 U13.1 | S4PU.1 66.94,17.41 63.16,17.41 | J5.3 64.75,12 63.79,12.96 63.79,16.78 63.16,17.41 | S4PD.2 59.86,17.61 62.96,17.61
SIG4_BUFF
  Top 0.381: U13.3 U13.4 64.15,20.17 63.59,19.61 62.51,19.61 61.96,20.16 61.96,22.9 59.98,24.87 59.98,27.83 60.18,28.03 60.35,28.03 U9.2
SIG4_READ
  Top 0.381: U4.4 14.52,36.22 14.52,36.05 14.72,35.85 14.74,35.85 17.4,33.2 36.14,33.2 37.5,31.83 68.85,31.83 70.12,30.56 70.12,30.48 70.12,27.86 68.72,26.46 66.52,26.46 U9.5

### Text on the board
tDocu: PULSE | CAN | +5V | HyTech Racing 2022 / Sensor Acquistion Board rev3 / Designed by Bo Han Zhu